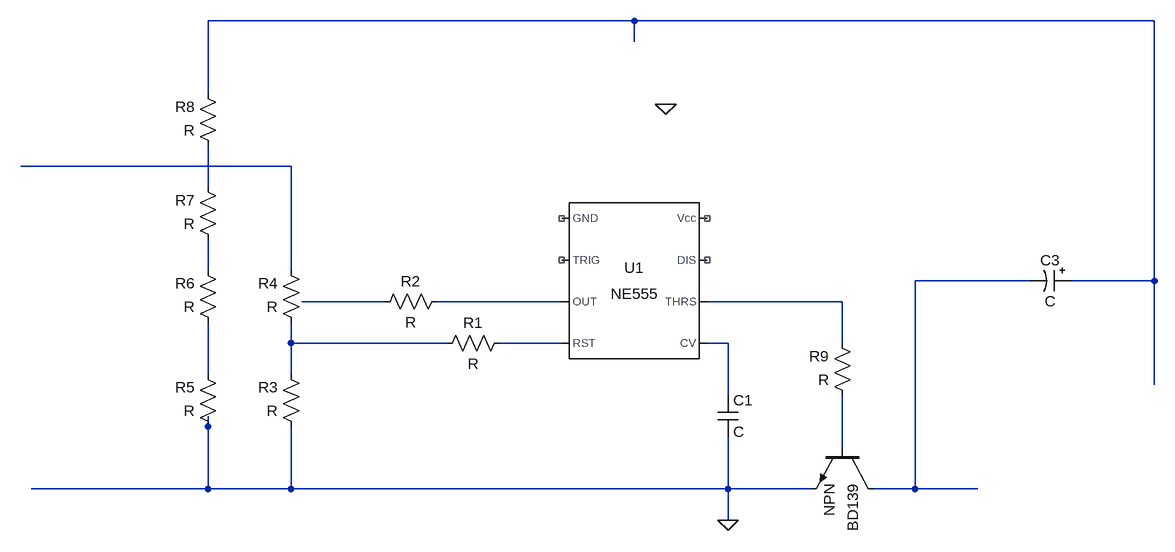
[diagram p0: schematic Draft2.asc]
Draft2.asc, the LTspice schematic file:
Version 4
SHEET 1 1048 680
WIRE 240 -208 -416 -208
WIRE 1040 -208 240 -208
WIRE 240 -176 240 -208
WIRE -416 -96 -416 -208
WIRE -288 16 -704 16
WIRE -416 48 -416 -16
WIRE -416 176 -416 128
WIRE -288 176 -288 16
WIRE 848 192 672 192
WIRE 1040 192 1040 -208
WIRE 1040 192 912 192
WIRE -144 224 -272 224
WIRE 128 224 -64 224
WIRE 560 224 352 224
WIRE -288 288 -288 256
WIRE -48 288 -288 288
WIRE 128 288 32 288
WIRE 384 288 352 288
WIRE 560 288 560 224
WIRE -416 336 -416 256
WIRE -288 336 -288 288
WIRE 1040 352 1040 192
WIRE 384 368 384 288
WIRE -416 416 -416 400
WIRE 560 448 560 368
WIRE -416 512 -416 416
WIRE -416 512 -688 512
WIRE -288 512 -288 416
WIRE -288 512 -416 512
WIRE 384 512 384 432
WIRE 384 512 -288 512
WIRE 512 512 384 512
WIRE 672 512 672 192
WIRE 672 512 608 512
WIRE 768 512 672 512
WIRE 384 560 384 512
FLAG 288 -80 0
FLAG 384 560 0
SYMBOL Misc\\NE555 240 192 R0
SYMATTR InstName U1
SYMBOL res 48 272 R90
WINDOW 0 0 56 VBottom 2
WINDOW 3 32 56 VTop 2
SYMATTR InstName R1
SYMBOL res -48 208 R90
WINDOW 0 0 56 VBottom 2
WINDOW 3 32 56 VTop 2
SYMATTR InstName R2
SYMBOL res -272 432 R180
WINDOW 0 36 76 Left 2
WINDOW 3 36 40 Left 2
SYMATTR InstName R3
SYMBOL res -272 272 R180
WINDOW 0 36 76 Left 2
WINDOW 3 36 40 Left 2
SYMATTR InstName R4
SYMBOL res -400 432 R180
WINDOW 0 36 76 Left 2
WINDOW 3 36 40 Left 2
SYMATTR InstName R5
SYMBOL res -400 272 R180
WINDOW 0 36 76 Left 2
WINDOW 3 36 40 Left 2
SYMATTR InstName R6
SYMBOL res -400 144 R180
WINDOW 0 36 76 Left 2
WINDOW 3 36 40 Left 2
SYMATTR InstName R7
SYMBOL res -400 0 R180
WINDOW 0 36 76 Left 2
WINDOW 3 36 40 Left 2
SYMATTR InstName R8
SYMBOL res 576 384 R180
WINDOW 0 36 76 Left 2
WINDOW 3 36 40 Left 2
SYMATTR InstName R9
SYMBOL cap 368 368 R0
SYMATTR InstName C1
SYMBOL npn3 608 448 R90
SYMATTR InstName BD139
SYMBOL polcap 912 176 R90
WINDOW 0 0 32 VBottom 2
WINDOW 3 32 32 VTop 2
SYMATTR InstName C3

The netlist it stands for:
* Draft2.asc
XU1 NC_01 NC_02 N007 N010 N011 N008 NC_03 NC_04 NE555  ; pins GND TRIG OUT RST CV THRS DIS Vcc
R1 N010 N009 R
R2 N007 N006 R
R3 0 N009 R
R4 N009 N002 R
R5 0 N012 R
R6 N012 N004 R
R7 N004 N003 R
R8 N003 N001 R
R9 N013 N008 R
C1 N011 0 C
Q§BD139 N005 N013 0 0 NPN
C3 N001 N005 C
.model NPN NPN
.model PNP PNP
.lib standard.bjt
.lib NE555.sub
.backanno
.end